# Altium schematic sheet ACS712.SchDoc
size A3
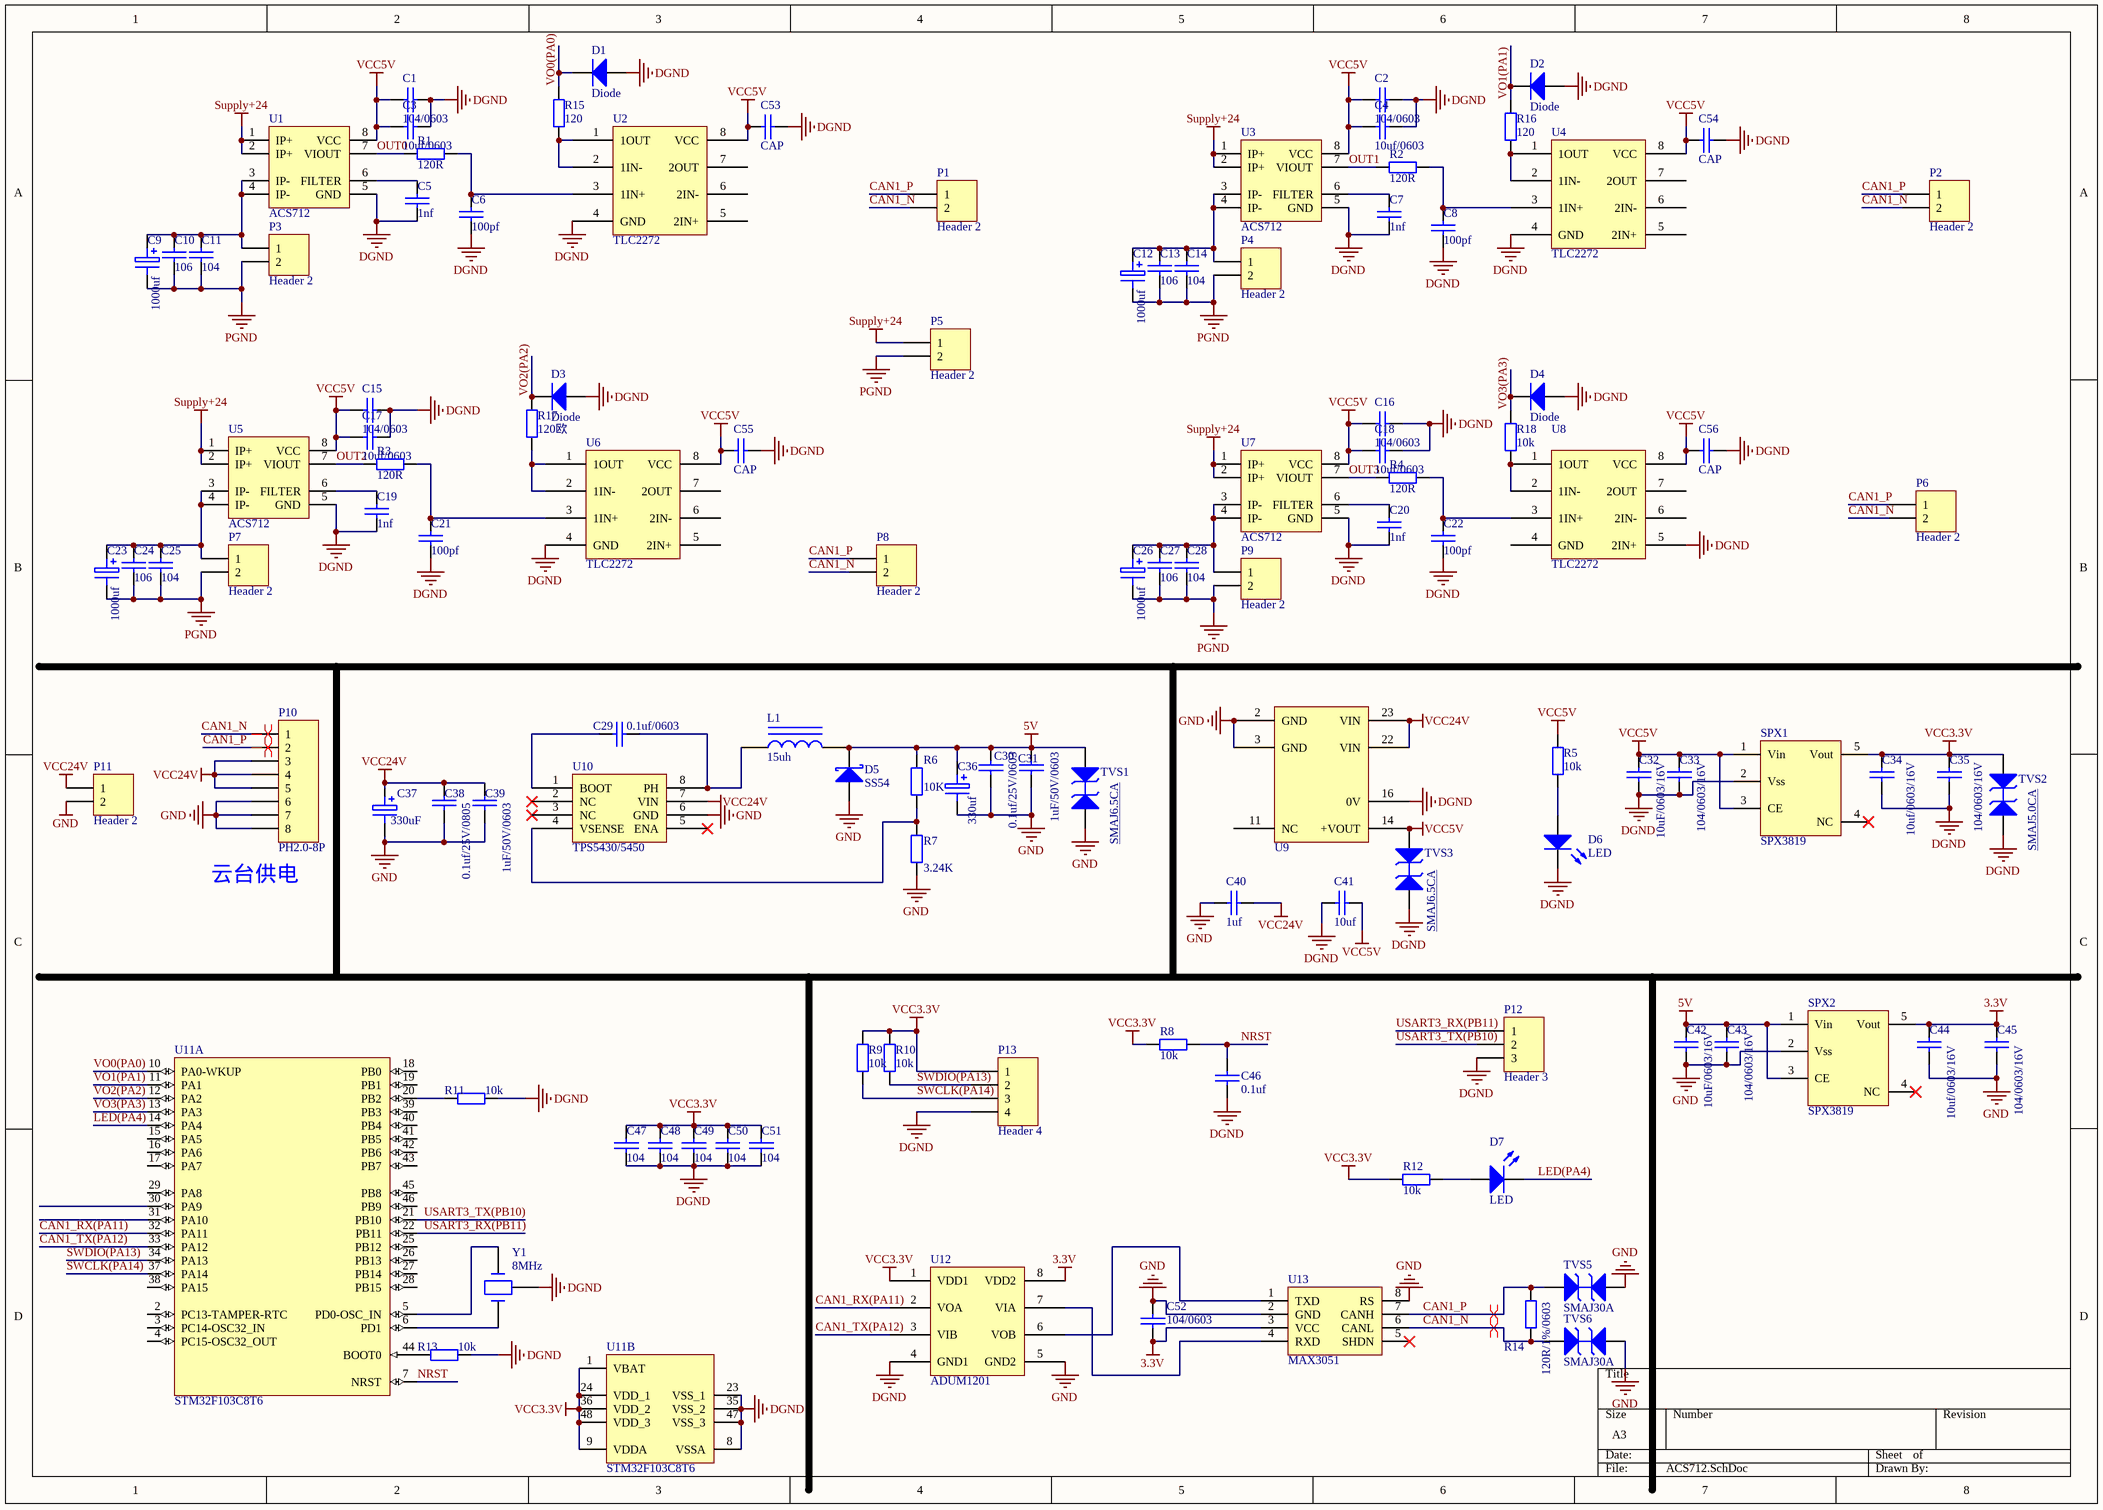
[diagram p0: ACS712.SchDoc]

## Parts
C1  104/0603  [C0603]
C2  104/0603  [C0603]
C3  10uf/0603  [C0603]
C4  10uf/0603  [C0603]
C5  1nf  [C0603]
C6  100pf  [C0603]
C7  1nf  [C0603]
C8  100pf  [C0603]
C9  1000uf  [C13x20]
C10  106  [C0603]
C11  104  [C0603]
C12  1000uf  [C13x20]
C13  106  [C0603]
C14  104  [C0603]
C15  104/0603  [C0603]
C16  104/0603  [C0603]
C17  10uf/0603  [C0603]
C18  10uf/0603  [C0603]
C19  1nf  [C0603]
C20  1nf  [C0603]
C21  100pf  [C0603]
C22  100pf  [C0603]
C23  1000uf  [C13x20]
C24  106  [C0603]
C25  104  [C0603]
C26  1000uf  [C13x20]
C27  106  [C0603]
C28  104  [C0603]
C29  0.1uf/0603  [C0603]
C30  0.1uf/25V/0603  [C0603]
C31  1uF/50V/0603  [C0603]
C32  10uF/0603/16V  [C0603]
C33  104/0603/16V  [C0603]
C34  104/0603/16V  [C0603]  (value not drawn)
C35  104/0603/16V  [C0603]
C36  330uf  [C3528]
C37  330uF  [C10x16]
C38  0.1uf/25V/0805  [C0603]
C39  1uF/50V/0603  [C0603]
C40  1uf  [C0805]
C41  10uf  [C0805]
C42  10uF/0603/16V  [C0603]
C43  104/0603/16V  [C0603]
C44  104/0603/16V  [C0603]  (value not drawn)
C45  104/0603/16V  [C0603]
C46  0.1uf  [C0603]
C47  104  [C0603]
C48  104  [C0603]
C49  104  [C0603]
C50  104  [C0603]
C51  104  [C0603]
C52  104/0603  [C0603]
C53  CAP  [C0603]
C54  CAP  [C0603]
C55  CAP  [C0603]
C56  CAP  [C0603]
D1  Diode  [D1206]
D2  Diode  [D1206]
D3  Diode  [D1206]
D4  Diode  [D1206]
D5  SS54  [DO-214AA]
D6  LED  [R0603]
D7  LED  [R0603]
L1  15uh  [L0630]
P1  Header 2  [GH1.25-2P]
P2  Header 2  [GH1.25-2P]
P3  Header 2  [XT30U-F]
P4  Header 2  [XT30U-F]
P5  Header 2  [XT30U-F]
P6  Header 2  [GH1.25-2P]
P7  Header 2  [XT30U-F]
P8  Header 2  [GH1.25-2P]
P9  Header 2  [XT30U-F]
P10  PH2.0-8P  [PH2.0-8P]
P11  Header 2  [XT30U-F]
P12  Header 3  [GH1.25-3P]
P13  Header 4  [GH1.25-4P]
R1  120R  [R0603]
R2  120R  [R0603]
R3  120R  [R0603]
R4  120R  [R0603]
R5  10k  [R0603]
R6  10K  [R0603]
R7  3.24K  [R0603]
R8  10k  [R0603]
R9  10k  [R0603]
R10  10k  [R0603]
R11  10k  [R0603]
R12  10k  [R0603]
R13  10k  [R0603]
R14  120R/1%/0603  [R0603]
R15  120  [R0603]
R16  120  [R0603]
R17  120欧  [R0603]
R18  10k  [R0603]
SPX1  SPX3819  [SOT23-5]
SPX2  SPX3819  [SOT23-5]
TVS1  SMAJ6.5CA  [DO-214AC]
TVS2  SMAJ5.0CA  [DO-214AC]
TVS3  SMAJ6.5CA  [DO-214AC]
TVS5  SMAJ30A  [DO-214AC]
TVS6  SMAJ30A  [DO-214AC]
U1  ACS712  [SOIC-8]
U2  TLC2272  [SOIC-8]
U3  ACS712  [SOIC-8]
U4  TLC2272  [SOIC-8]
U5  ACS712  [SOIC-8]
U6  TLC2272  [SOIC-8]
U7  ACS712  [SOIC-8]
U8  TLC2272  [SOIC-8]
U9  VRB_ZP-6WR3  [VRB_ZP-6WR3]  (value not drawn)
U10  TPS5430/5450  [SOIC-8]
U11  STM32F103C8T6  [LQFP48_N]  (parts A,B of 2)
U12  ADUM1201  [SOIC-8]
U13  MAX3051  [SOT-23-8P]
Y1  8MHz  [CSTCE]

## Nets
3.3V: C44.2 C45.2 C52.1 SPX2.5(Vout) U12.8(VDD2) U13.3(VCC)
5V: C30.2 C31.2 C36.1 C42.2 C43.2 D5.2(K) L1.2 R6.1 SPX2.1(Vin) SPX2.3(CE) TVS1.2(K)
DGND: C1.1 C2.1 C3.1 C4.1 C5.1 C6.1 C7.1 C8.1 C15.1 C16.1 C17.1 C18.1 C19.1 C20.1 C21.1 C22.1 C32.1 C33.1 C34.1 C35.1 C41.1 C46.1 C47.1 C48.1 C49.1 C50.1 C51.1 C53.1 C54.1 C55.1 C56.1 D1.1(A) D2.1(A) D3.1(A) D4.1(A) D6.2(K) P12.3 P13.4 R11.1 R13.1 SPX1.2(Vss) TVS2.1(A) TVS3.2(K) U1.5(GND) U2.4(GND) U3.5(GND) U4.4(GND) U5.5(GND) U6.4(GND) U7.5(GND) U8.5(2IN+) U9.16(0V) U11.8(VSSA) U11.23(VSS_1) U11.35(VSS_2) U11.47(VSS_3) U12.4(GND1) Y1.3(OSC3)
GND: C30.1 C31.1 C36.2(E) C37.2(E) C38.1 C39.1 C40.1 C42.1 C43.1 C44.1 C45.1 C52.2 D5.1(A) P10.6 P10.7 P10.8 P11.2 R7.2 SPX2.2(Vss) TVS1.1(A) TVS5.1(A) TVS6.1(A) U9.2(GND) U9.3(GND) U10.6(GND) U12.5(GND2) U13.2(GND) U13.8(RS)
PGND: C9.2(E) C10.1 C11.1 C12.2(E) C13.1 C14.1 C23.2(E) C24.1 C25.1 C26.2(E) C27.1 C28.1 P3.2 P4.2 P5.2 P7.2 P9.2
Supply+24: P5.1 U1.1(IP+) U1.2(IP+) U3.1(IP+) U3.2(IP+) U5.1(IP+) U5.2(IP+) U7.1(IP+) U7.2(IP+)
VCC3.3V: C34.2 C35.2 C47.2 C48.2 C49.2 C50.2 C51.2 P13.1 R8.2 R9.1 R10.1 R12.2 SPX1.5(Vout) TVS2.2(K) U11.1(VBAT) U11.9(VDDA) U11.24(VDD_1) U11.36(VDD_2) U11.48(VDD_3) U12.1(VDD1)
VCC5V: C1.2 C2.2 C3.2 C4.2 C15.2 C16.2 C17.2 C18.2 C32.2 C33.2 C41.2 C53.2 C54.2 C55.2 C56.2 R5.1 SPX1.1(Vin) SPX1.3(CE) TVS3.1(A) U1.8(VCC) U2.8(VCC) U3.8(VCC) U4.8(VCC) U5.8(VCC) U6.8(VCC) U7.8(VCC) U8.8(VCC) U9.14(+VOUT)
VCC24V: C37.1 C38.2 C39.2 C40.2 P10.3 P10.4 P10.5 P11.1 U9.22(VIN) U9.23(VIN) U10.7(VIN)
CAN1_N: P1.2 P2.2 P6.2 P8.2 P10.1 R14.1 TVS6.2(K) U13.6(CANL)
CAN1_P: P1.1 P2.1 P6.1 P8.1 P10.2 R14.2 TVS5.2(K) U13.7(CANH)
CAN1_RX(PA11): U11.32(PA11) U12.2(VOA)
CAN1_TX(PA12): U11.33(PA12) U12.3(VIB)
LED(PA4): D7.2(K) U11.14(PA4)
NRST: C46.2 R8.1 U11.7(NRST)
OUT0: R1.2 U1.7(VIOUT)
OUT1: R2.2 U3.7(VIOUT)
OUT2: R3.2 U5.7(VIOUT)
OUT3: R4.2 U7.7(VIOUT)
SWCLK(PA14): P13.3 R9.2 U11.37(PA14)
SWDIO(PA13): P13.2 R10.2 U11.34(PA13)
USART3_RX(PB11): P12.1 U11.22(PB11)
USART3_TX(PB10): P12.2 U11.21(PB10)
VO0(PA0): D1.2(K) R15.1 U11.10(PA0-WKUP)
VO1(PA1): D2.2(K) R16.1 U11.11(PA1)
VO2(PA2): D3.2(K) R17.2 U11.12(PA2)
VO3(PA3): D4.2(K) R18.1 U11.13(PA3)
NetC5_2: C5.2 U1.6(FILTER)
NetC6_2: C6.2 R1.1 U2.3(1IN+)
NetC7_2: C7.2 U3.6(FILTER)
NetC8_2: C8.2 R2.1 U4.3(1IN+)
NetC9_1: C9.1 C10.2 C11.2 P3.1 U1.3(IP-) U1.4(IP-)
NetC12_1: C12.1 C13.2 C14.2 P4.1 U3.3(IP-) U3.4(IP-)
NetC19_2: C19.2 U5.6(FILTER)
NetC20_2: C20.2 U7.6(FILTER)
NetC21_2: C21.2 R3.1 U6.3(1IN+)
NetC22_2: C22.2 R4.1 U8.3(1IN+)
NetC23_1: C23.1 C24.2 C25.2 P7.1 U5.3(IP-) U5.4(IP-)
NetC26_1: C26.1 C27.2 C28.2 P9.1 U7.3(IP-) U7.4(IP-)
NetC29_1: C29.1 L1.1 U10.8(PH)
NetC29_2: C29.2 U10.1(BOOT)
NetD6_1: D6.1(A) R5.2
NetD7_1: D7.1(A) R12.1
NetR6_2: R6.2 R7.1 U10.4(VSENSE)
NetR11_2: R11.2 U11.20(PB2)
NetR13_2: R13.2 U11.44(BOOT0)
NetR15_2: R15.2 U2.1(1OUT) U2.2(1IN-)
NetR16_2: R16.2 U4.1(1OUT) U4.2(1IN-)
NetR17_1: R17.1 U6.1(1OUT) U6.2(1IN-)
NetR18_2: R18.2 U8.1(1OUT) U8.2(1IN-)
NetU11_5: U11.5(PD0-OSC_IN) Y1.1(OSC1)
NetU11_6: U11.6(PD1) Y1.2(OSC2)
NetU12_6: U12.6(VOB) U13.1(TXD)
NetU12_7: U12.7(VIA) U13.4(RXD)

Not connected (* = marked no-connect by the designer): SPX1 4(NC)*; SPX2 4(NC)*; U2 5(2IN+) 6(2IN-) 7(2OUT); U4 5(2IN+) 6(2IN-) 7(2OUT); U6 5(2IN+) 6(2IN-) 7(2OUT); U8 4(GND) 6(2IN-) 7(2OUT); U9 11(NC); U10 2(NC)* 3(NC)* 5(ENA)*; U11 2(PC13-TAMPER-RTC) 3(PC14-OSC32_IN) 4(PC15-OSC32_OUT) 15(PA5) 16(PA6) 17(PA7) 18(PB0) 19(PB1) 25(PB12) 26(PB13) 27(PB14) 28(PB15) 29(PA8) 30(PA9) 31(PA10) 38(PA15) 39(PB3) 40(PB4) 41(PB5) 42(PB6) 43(PB7) 45(PB8) 46(PB9); U13 5(SHDN)*

## Layout directives
differential pair: CAN1_N, CAN1_P

## Notes on the sheet
- (near P10) 云台供电
- (in symbol CAP) 10uf/0603/16V

## Library data of the parts
C1-C8 C10 C11 C13-C22 C24 C25 C27-C35 C38-C52 = CAP
C9 C12 C23 C26 C36 C37 = CAP POL
D5 = Diode Schottky
L1 = L电感
P1-P9 P11 = Header 2: Header, 2-Pin; LatestRevisionDate: 17-Jul-2002; LatestRevisionNote: Re-released for DXP Platform.; Publisher: Altium Limited
P10 = Header 8: Header, 8-Pin; LatestRevisionDate: 17-Jul-2002; LatestRevisionNote: Re-released for DXP Platform.; Publisher: Altium Limited
P12 = Header 3: Header, 3-Pin; LatestRevisionDate: 17-Jul-2002; LatestRevisionNote: Re-released for DXP Platform.; Publisher: Altium Limited
P13 = Header 4: Header, 4-Pin; LatestRevisionDate: 17-Jul-2002; LatestRevisionNote: Re-released for DXP Platform.; Publisher: Altium Limited
R1-R18 = Resistance
SPX1 SPX2 = XC6219
TVS1-TVS3 TVS5 = TVS: SMBJ24CA
TVS6 = TVS
U11 = STM32F103C8T6: STM32 ARM-based 32-bit MCU Performance Line with 64 kB Flash, 20 kB Internal RAM, -40 to +85癈 Temperature, 48-Pin LQFP, Tray; DatasheetVersion: rev13.0, Apr-2011; PackageVersion: rev13, Apr-2011; PackageReference: LQFP48; PackageDescription: 48-Pin Low-Profile Quad Flat Pack, 7 x 7 mm Body, 0.5 mm Pitch (LQFP48); ComponentLink1Description: Manufacturer URL; ComponentLink1URL: http://www.st.com/; ComponentLink2Description: STM32F103 Datasheet; ComponentLink2URL: http://www.st.com/internet/com/TECHNICAL_RESOURCES/TECHNICAL_LITERATURE/DATASHEET/CD00161566.pdf; ComponentLink3Description: STM32 Family Web Page; ComponentLink3URL: www.st.com/stm32
Y1 = CSTCE